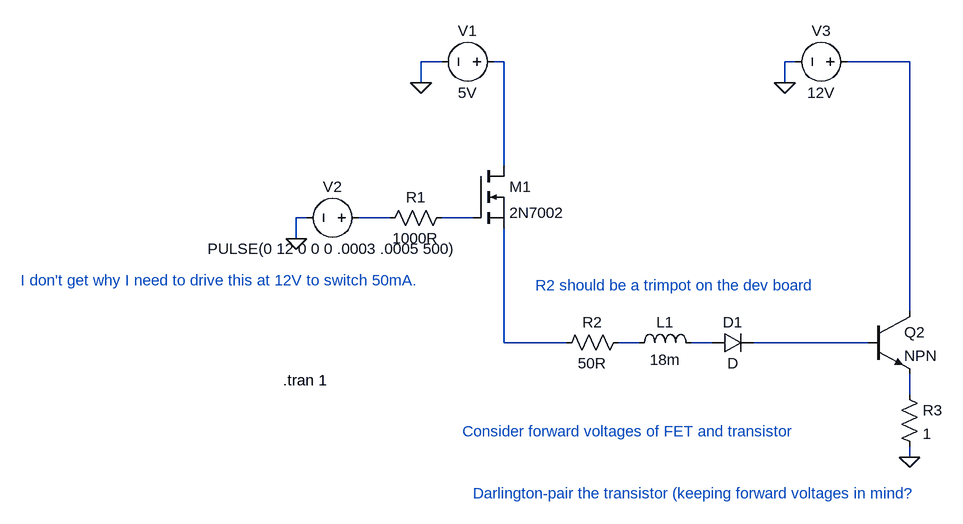
[diagram p0: schematic Power_Transistor_Take_2.asc]
Power_Transistor_Take_2.asc, the LTspice schematic file:
Version 4
SHEET 1 880 680
WIRE 32 -48 0 -48
WIRE 128 -48 112 -48
WIRE 576 -48 560 -48
WIRE 752 -48 656 -48
WIRE 0 -16 0 -48
WIRE 560 -16 560 -48
WIRE 128 112 128 -48
WIRE -176 192 -192 192
WIRE -48 192 -96 192
WIRE 80 192 32 192
WIRE -192 224 -192 192
WIRE 752 336 752 -48
WIRE 128 384 128 208
WIRE 224 384 128 384
WIRE 336 384 304 384
WIRE 448 384 416 384
WIRE 688 384 512 384
WIRE 752 464 752 432
WIRE 752 560 752 544
FLAG 0 -16 0
FLAG -192 224 0
FLAG 560 -16 0
FLAG 752 560 0
SYMBOL nmos 80 112 R0
SYMATTR InstName M1
SYMATTR Value 2N7002
SYMBOL npn 688 336 R0
SYMATTR InstName Q2
SYMBOL voltage 128 -48 R90
WINDOW 0 -32 56 VBottom 2
WINDOW 3 32 56 VTop 2
WINDOW 123 0 0 Left 0
WINDOW 39 0 0 Left 0
SYMATTR InstName V1
SYMATTR Value 5V
SYMBOL voltage -80 192 R90
WINDOW 0 -32 56 VBottom 2
WINDOW 3 32 56 VTop 2
WINDOW 123 0 0 Left 0
WINDOW 39 0 0 Left 0
SYMATTR InstName V2
SYMATTR Value PULSE(0 12 0 0 0 .0003 .0005 500)
SYMBOL voltage 672 -48 R90
WINDOW 0 -32 56 VBottom 2
WINDOW 3 32 56 VTop 2
WINDOW 123 0 0 Left 0
WINDOW 39 0 0 Left 0
SYMATTR InstName V3
SYMATTR Value 12V
SYMBOL res 48 176 R90
WINDOW 0 0 56 VBottom 2
WINDOW 3 32 56 VTop 2
SYMATTR InstName R1
SYMATTR Value 1000R
SYMBOL res 208 400 R270
WINDOW 0 32 56 VTop 2
WINDOW 3 0 56 VBottom 2
SYMATTR InstName R2
SYMATTR Value 50R
SYMBOL res 736 448 R0
SYMATTR InstName R3
SYMATTR Value 1
SYMBOL ind 320 400 R270
WINDOW 0 32 56 VTop 2
WINDOW 3 5 56 VBottom 2
SYMATTR InstName L1
SYMATTR Value 18m
SYMATTR SpiceLine Ipk=0.1 Rser=30.96 Rpar=1.6956e+006 Cpar=0 mfg="Coilcraft" pn="RFB0810-183"
SYMBOL diode 448 400 R270
WINDOW 0 32 32 VTop 2
WINDOW 3 0 32 VBottom 2
SYMATTR InstName D1
TEXT -212 442 Left 2 !.tran 1
TEXT -616 288 Left 2 ;I don't get why I need to drive this at 12V to switch 50mA.
TEXT 176 296 Left 2 ;R2 should be a trimpot on the dev board
TEXT 64 520 Left 2 ;Consider forward voltages of FET and transistor
TEXT 80 616 Left 2 ;Darlington-pair the transistor (keeping forward voltages in mind?

The netlist it stands for:
* Power_Transistor_Take_2.asc
M1 N001 N004 N005 N005 2N7002
Q2 N002 N008 N009 0 NPN
V1 N001 0 5V
V2 N003 0 PULSE(0 12 0 0 0 .0003 .0005 500)
V3 N002 0 12V
R1 N004 N003 1000R
R2 N005 N006 50R
R3 N009 0 1
L1 N006 N007 18m Ipk=0.1 Rser=30.96 Rpar=1.6956e+006 Cpar=0 mfg="Coilcraft" pn="RFB0810-183"
D1 N007 N008 D
.model D D
.lib standard.dio
.model NPN NPN
.model PNP PNP
.lib standard.bjt
.model NMOS NMOS
.model PMOS PMOS
.lib standard.mos
.tran 1
* I don't get why I need to drive this at 12V to switch 50mA.
* R2 should be a trimpot on the dev board
* Consider forward voltages of FET and transistor
* Darlington-pair the transistor (keeping forward voltages in mind?
.backanno
.end